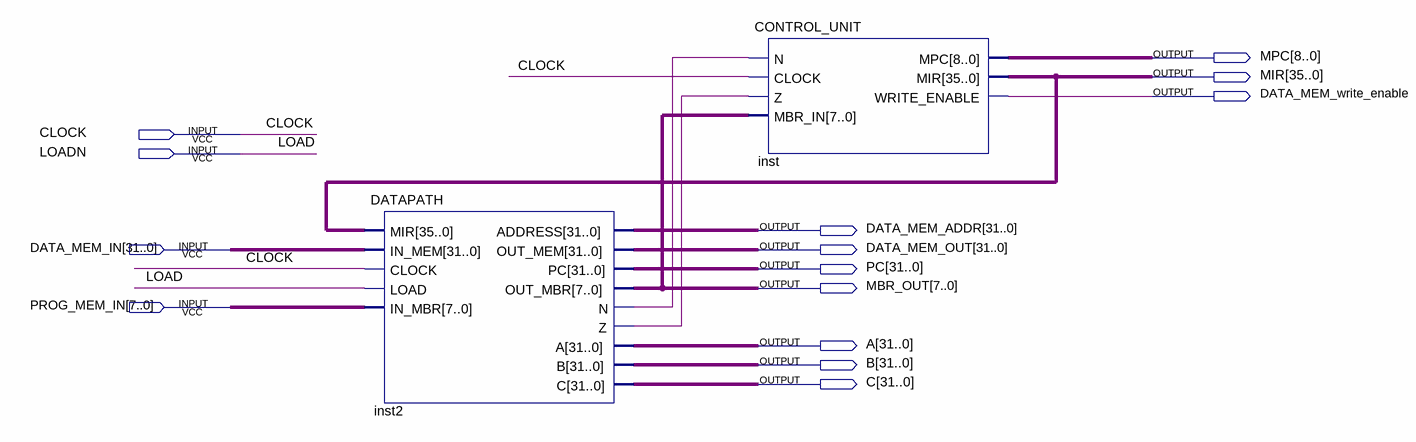
[diagram p0: schematic sheet]
// Quartus schematic CPU.bdf as structural Verilog: 2 symbols, 14 pins
module CPU (
  input  CLOCK,
  input  LOADN,
  input  [31:0] DATA_MEM_IN,
  input  [7:0] PROG_MEM_IN,
  output [8:0] MPC,
  output [35:0] MIR,
  output DATA_MEM_write_enable,
  output [31:0] DATA_MEM_ADDR,
  output [31:0] DATA_MEM_OUT,
  output [31:0] PC,
  output [7:0] MBR_OUT,
  output [31:0] A,
  output [31:0] B,
  output [31:0] C
);

  wire inst2_n, inst2_z;

  DATAPATH inst2 (
    .MIR(MIR), .IN_MEM(DATA_MEM_IN), .CLOCK(CLOCK), .LOAD(LOADN), .IN_MBR(PROG_MEM_IN),
    .ADDRESS(DATA_MEM_ADDR), .OUT_MEM(DATA_MEM_OUT), .PC(PC), .OUT_MBR(MBR_OUT), .N(inst2_n), .Z(inst2_z),
    .A(A), .B(B), .C(C));
  CONTROL_UNIT inst (
    .N(inst2_n), .CLOCK(CLOCK), .Z(inst2_z), .MBR_IN(MBR_OUT), .MPC(MPC), .MIR(MIR),
    .WRITE_ENABLE(DATA_MEM_write_enable));

  // Other names for the same wires on the sheet: LOAD = LOADN
endmodule
